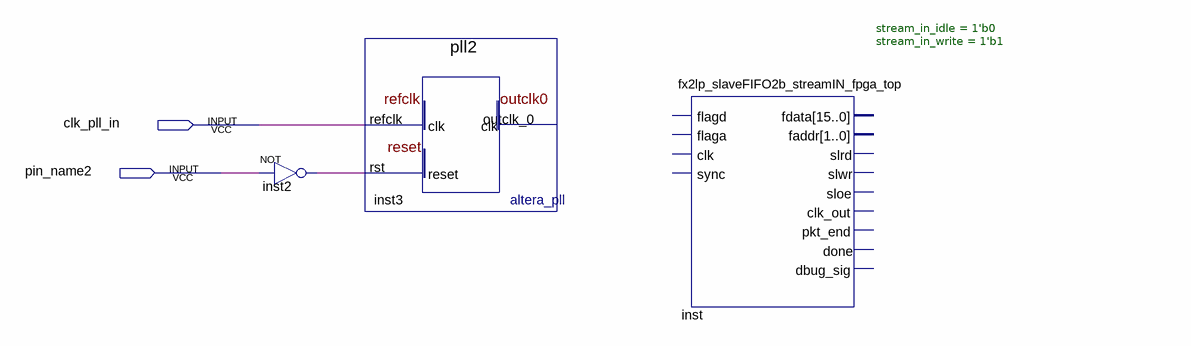
[diagram p0: schematic sheet]
// Quartus schematic blocks.bdf as structural Verilog: 3 symbols, 2 pins
module blocks (
  input  clk_pll_in,
  input  pin_name2
);

  wire inst2_out;

  not inst2 (inst2_out, pin_name2);
  pll2 inst3 (.refclk(clk_pll_in), .rst(inst2_out));  // open: outclk_0
  fx2lp_slaveFIFO2b_streamIN_fpga_top #(.stream_in_idle(1'b0), .stream_in_write(1'b1)) inst ();  // open: flagd, flaga, clk, sync, fdata, faddr, slrd, slwr, sloe, clk_out, pkt_end, done, dbug_sig
endmodule
